# Altium schematic sheet Temperature.SchDoc
size A4
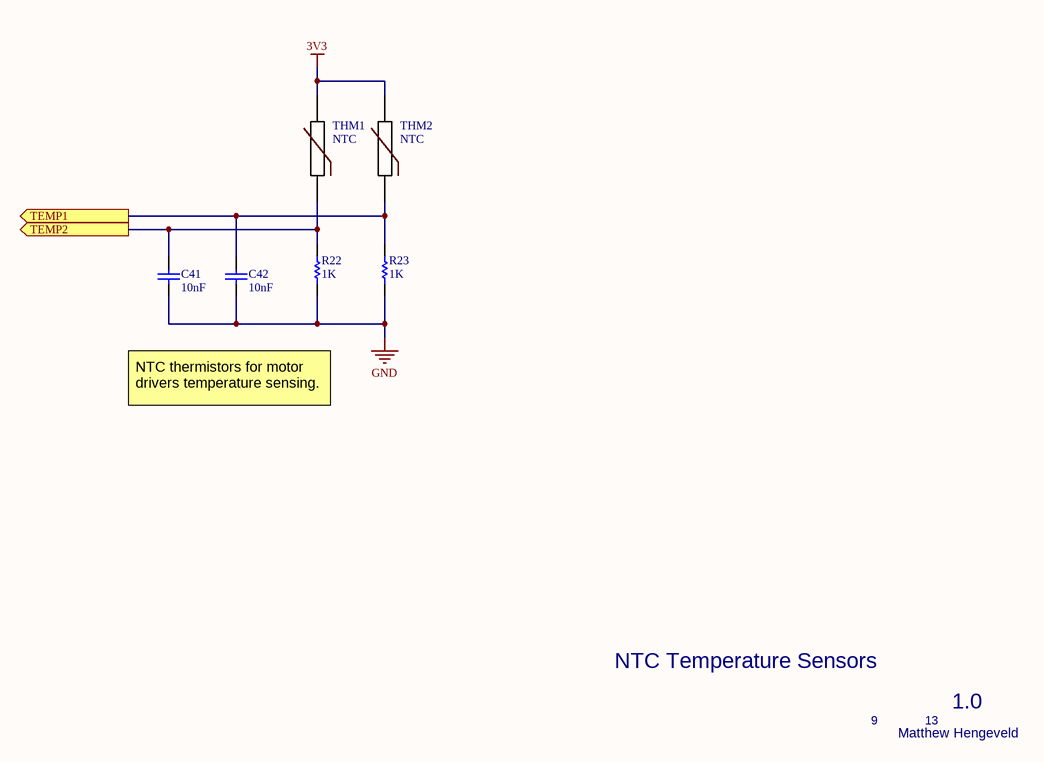
[diagram p0: Temperature.SchDoc]

## Parts
C41  10nF  [CAPC1608X92X38LL15T08]
C42  10nF  [CAPC1608X92X38LL15T08]
R22  1K  [RESC1608X55X30LL15T15]
R23  1K  [RESC1608X55X30LL15T15]
THM1  NTC  [NTC]
THM2  NTC  [NTC]

## Ports
TEMP1 (out), TEMP2 (out)

## Nets
3V3: THM1.2 THM2.2
GND: C41.1 C42.1 R22.1 R23.1
TEMP1: C42.2 R23.2 THM2.1 ; port TEMP1
TEMP2: C41.2 R22.2 THM1.1 ; port TEMP2

## Notes on the sheet
- NTC thermistors for motor drivers temperature sensing.
- NTC Temperature Sensors
- 9
- 13
- 1.0
- Matthew Hengeveld

## Library data of the parts
C41 C42 = CMP-2006-01974-1: Part Number: VJ0603Y104KNXAO; Manufacturer: Vitramon
R22 R23 = CMP-2000-00704-1: Manufacturer: Panasonic; Part Number: ERJ-3GEYJ103V